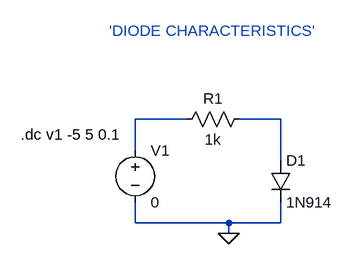
[diagram p0: schematic 5.Diode Characteristics.asc]
5.Diode Characteristics.asc, the LTspice schematic file:
Version 4
SHEET 1 880 680
WIRE 272 128 192 128
WIRE 416 128 352 128
WIRE 192 176 192 128
WIRE 416 192 416 128
WIRE 192 288 192 256
WIRE 336 288 192 288
WIRE 416 288 416 256
WIRE 416 288 336 288
WIRE 336 304 336 288
FLAG 336 304 0
SYMBOL voltage 192 160 R0
WINDOW 123 0 0 Left 0
WINDOW 39 0 0 Left 0
SYMATTR InstName V1
SYMATTR Value 0
SYMBOL res 368 112 R90
WINDOW 0 0 56 VBottom 2
WINDOW 3 32 56 VTop 2
SYMATTR InstName R1
SYMATTR Value 1k
SYMBOL diode 400 192 R0
SYMATTR InstName D1
SYMATTR Value 1N914
TEXT 152 -8 Left 2 ;'DIODE CHARACTERISTICS'
TEXT 16 152 Left 2 !.dc v1 -5 5 0.1

The netlist it stands for:
* 5.Diode Characteristics.asc
V1 N001 0 0
R1 N002 N001 1k
D1 N002 0 1N914
.model D D
.lib standard.dio
* 'DIODE CHARACTERISTICS'
.dc v1 -5 5 0.1
.backanno
.end